# Altium project MSXIV_SolarSense.PrjPcb (part 2 of 3)

## Sheet Current_and_Relay_Sense.SchDoc
size B; Organization: Midnight Sun Solar Rayce Car Team; Address1: University of Waterloo; Address2: 200 University Ave W; Address3: Waterloo, ON, Canada; Address4: N2L 3E9; Website: www.uwmidsun.com
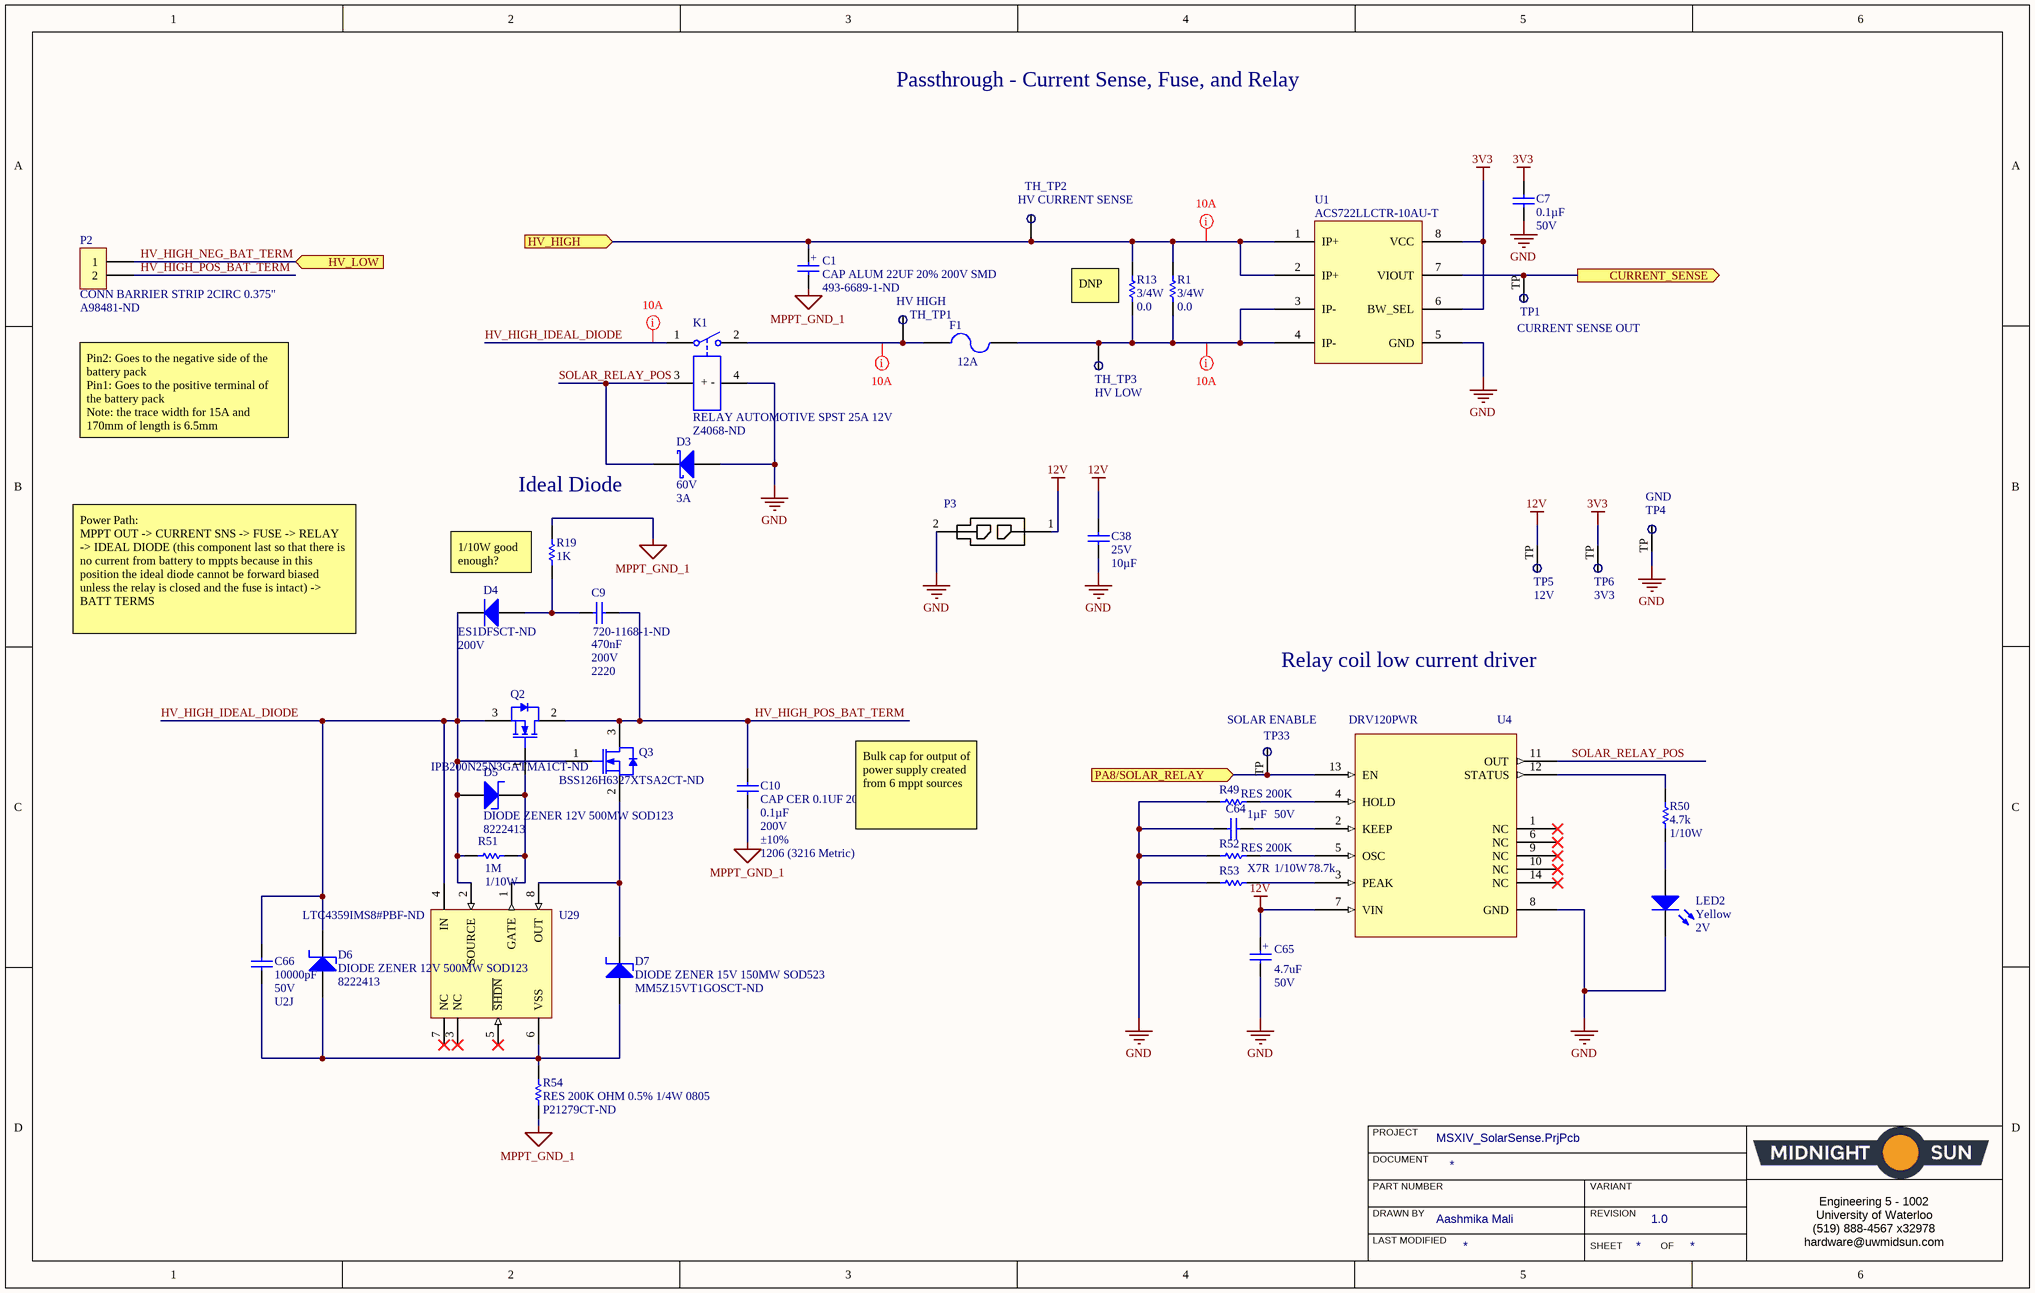
[diagram p4: Current_and_Relay_Sense.SchDoc]

### Parts
C1  CAP ALUM 22UF 20% 200V SMD  Supplier Part Number 1: 493-6689-1-ND  [CAP ALUM 10MMx10MM UUB2D100MNL1GS]
C7  Capacitance: 0.1µF  Voltage: 50V  [CAP, 0603]  (hidden comment: CAP CER 0.1UF 50V 10% X7R 0603)
C9  Capacitance: 470nF  Voltage Rating (DC): 200V  Case/Package: 2220  Supplier Part Number 1: 720-1168-1-ND  [CAP, 2220]  (hidden comment: CAP CER 0.47UF 200V X7R 2220)
C10  CAP CER 0.1UF 200V X7R 1206  Capacitance: 0.1µF  Voltage - Rated: 200V  Tolerance: ±10%  Package / Case: 1206 (3216 Metric)  [CAP, 1206]
C38  Voltage - Rated: 25V  Capacitance: 10µF  [CAP, 0805]  (hidden comment: CAP CER 10uF 25V 10% X5R 0805)
C64  Capacitance: 1µF  Voltage: 50V  Temperature Coefficient: X7R  [CAP, 0603]  (hidden comment: CAP CER 1UF 50V 10% X7R 0603)
C65  Capacitance: 4.7uF  Voltage Rating (DC): 50V  [CAP ALUM 6.3MM RADIAL SMD]  (hidden comment: EEE-1HA4R7NP)
C66  Capacitance: 10000pF  Voltage: 50V  Temperature Coefficient: U2J  [CAP, 0603]  (hidden comment: CAP CER 10nF 50V 5% X7R 0603)
D3  Voltage - DC Reverse (Vr) (Max): 60V  Current - Average Rectified (Io): 3A  [Diode, SMA]  (hidden comment: DIODE SCHOTTKY 60V 3A SMA)
D4  Reverse Voltage: 200V  Supplier Part Number 1: ES1DFSCT-ND  [FAIR-SMA-2_V]  (hidden comment: DIODE GEN PURP 200V 1A SMA)
D5  DIODE ZENER 12V 500MW SOD123  Supplier Part Number 1: 8222413  [SOD123]
D6  DIODE ZENER 12V 500MW SOD123  Supplier Part Number 1: 8222413  [SOD123]
D7  DIODE ZENER 15V 150MW SOD523  Supplier Part Number 1: MM5Z15VT1GOSCT-ND  [SOD-523]
F1  Current Rating: 12A  [FUSE CLIPS 1A3400-09-R]  (hidden comment: FUSE 12 A 600VAC/DC KLM-12)
K1  RELAY AUTOMOTIVE SPST 25A 12V  Supplier Part Number 1: Z4068-ND  [RELAY AUTOMOTIVE SPST 25A 12V]
LED2  Color: Yellow  Voltage - Forward (Vf) (Typ): 2V  [LED_0603]  (hidden comment: LED YELLOW CLEAR 2.1V 0603)
P2  CONN BARRIER STRIP 2CIRC 0.375"  Supplier Part Number 1: A98481-ND  [TE_3-1437652-9]
P3  CONN 2POS MICRO-FIT 3mm  [CONN, 2POS MICRO-FIT]  (value not drawn)
Q2  Supplier Part Number 1: IPB200N25N3GATMA1CT-ND  [INF-PG-TO-263-3-2_A_M]  (hidden comment: MOSFET N-CH 250V 64A TO263-3)
Q3  Supplier Part Number 1: BSS126H6327XTSA2CT-ND  [INF-PG-SOT23_M]  (hidden comment: MOSFET N-CH 600V 0.021A SOT-2326)
R1  Power (Watts): 3/4W  Resistance: 0.0  [RES 1206]  (hidden comment: RES 0.0 OHM 3/4W 1206)
R13  Power (Watts): 3/4W  Resistance: 0.0  [RES 1206]  (hidden comment: RES 0.0 OHM 3/4W 1206)
R19  1K  [RES, 0603]
R49  RES 200K  [0805]
R50  Resistance (Ohms): 4.7k  Power (Watts): 1/10W  [RES, 0603]  (hidden comment: RES 4.7K OHM 1% 1/10W 0603)
R51  Resistance (Ohms): 1M  Power (Watts): 1/10W  [RES, 0603]  (hidden comment: RES 1M OHM 1% 1/10W 0603)
R52  RES 200K  [0805]
R53  Power (Watts): 1/10W  Resistance (Ohms): 78.7k  [RES, 0603]  (hidden comment: RES 78.7K OHM 1% 1/10W 0603)
R54  RES 200K OHM 0.5% 1/4W 0805  Supplier Part Number 1: P21279CT-ND  [0805]
TH_TP1  HV HIGH  [Thru Test Point]
TH_TP2  HV CURRENT SENSE  [Thru Test Point]
TH_TP3  HV LOW  [Thru Test Point]
TP1  CURRENT SENSE OUT  [Test Point]  (no BOM)
TP4  GND  [Test Point]  (no BOM)
TP5  12V  [Test Point]  (no BOM)
TP6  3V3  [Test Point]  (no BOM)
TP33  SOLAR ENABLE  [Test Point]  (no BOM)
U1  Manufacturer Part Number: ACS722LLCTR-10AU-T  [SOIC8]  (hidden comment: IC CURRENT SENSOR HALL EFFECT 8-SOIC)
U4  Manufacturer Part Number: DRV120PWR  [PW14]  (hidden comment: *)
U29  Supplier Part Number 1: LTC4359IMS8#PBF-ND  [LT-MS8-8_N]  (hidden comment: IC LTC4359HS8#PBF IDEAL DIODE CONTROLLER WITH REVE)

### Ports
CURRENT_SENSE (out), HV_HIGH (in), HV_LOW (in), PA8/SOLAR_RELAY (in)

### Nets
3V3: C7.1 TP6.TP U1.6(BW_SEL) U1.8(VCC)
12V: C38.1 C65.1 P3.1 TP5.TP U4.7(VIN)
GND: C7.2 C38.2 C64.1 C65.2 D3.1 K1.4(-) LED2.2(K) P3.2 R49.1 R52.1 R53.1 TP4.TP U1.5(GND) U4.8(GND)
HV_HIGH: C1.1 R1.1 R13.1 TH_TP2.TH_TP U1.1(IP+) U1.2(IP+) ; port HV_HIGH
HV_HIGH_NEG_BAT_TERM: C1.2 C10.2 P2.1 R19.1 R54.2 ; port HV_LOW  [also labelled MPPT_GND_1]
HV_HIGH_IDEAL_DIODE: C66.1 D4.2(K) D5.2(A) D6.1(K) K1.1 Q2.3(SOURCE) Q3.1(GATE) R51.1 U29.2(SOURCE) U29.4(IN)
HV_HIGH_POS_BAT_TERM: C9.2 C10.1 P2.2 Q2.2(DRAIN) Q3.3(DRAIN)
PA8/SOLAR_RELAY: TP33.TP U4.13(EN) ; port PA8/SOLAR_RELAY
SOLAR_RELAY_POS: D3.2 K1.3(+) U4.11(OUT)
NetC9_1: C9.1 D4.1(A) R19.2
NetC64_2: C64.2 U4.2(KEEP)
NetC66_2: C66.2 D6.2(A) D7.1(A) R54.1 U29.6(VSS)
NetD5_1: D5.1(K) Q2.1(GATE) R51.2 U29.1(GATE)
NetD7_2: D7.2(K) Q3.2(SOURCE) U29.8(OUT)
NetF1_1: F1.1 K1.2 TH_TP1.TH_TP
NetF1_2: F1.2 R1.2 R13.2 TH_TP3.TH_TP U1.3(IP-) U1.4(IP-)
NetLED2_1: LED2.1(A) R50.2
NetR18_1: TP1.TP U1.7(VIOUT) ; port CURRENT_SENSE
NetR49_2: R49.2 U4.4(HOLD)
NetR50_1: R50.1 U4.12(STATUS)
NetR52_2: R52.2 U4.5(OSC)
NetR53_2: R53.2 U4.3(PEAK)

Not connected (* = marked no-connect by the designer): U4 1(NC)* 6(NC)* 9(NC)* 10(NC)* 14(NC)*; U29 3(NC)* 5(~{SHDN})* 7(NC)*

### Layout directives
net class 10A: HV_HIGH, HV_HIGH_IDEAL_DIODE, NetF1_1, NetF1_2

### Notes on the sheet
- Passthrough - Current Sense, Fuse, and Relay
- (near R13) DNP
- Pin2: Goes to the negative side of the battery pack
  Pin1: Goes to the positive terminal of the battery pack
  Note: the trace width for 15A and 170mm of length is 6.5mm
- Ideal Diode
- (near R19) 1/10W good enough?
- Power Path:
  MPPT OUT -> CURRENT SNS -> FUSE -> RELAY -> IDEAL DIODE (this component last so that there is no current from battery to mppts because in this position the ideal diode cannot be forward biased unless the relay is closed and the fuse is intact) -> BATT TERMS
- Relay coil low current driver
- Bulk cap for output of power supply created from 6 mppt sources
- PROJECT
- DOCUMENT
- DRAWN BY
- LAST MODIFIED
- PART NUMBER
- REVISION
- SHEET
- VARIANT
- OF
- Engineering 5 - 1002
  University of Waterloo
  (519) 888-4567 x32978
  hardware@uwmidsun.com
- (in symbol CAP ALUM 4.7UF 20% 50V SMD) +
- (in symbol CAP ALUM 22UF 20% 200V SMD) +
- (in symbol RELAY AUTOMOTIVE SPST 25A 12V) + -

### Library data of the parts
C1 = CAP ALUM 22UF 20% 200V SMD: Aluminum Electrolytic Capacitors - SMD 200V 22uF 125C; Manufacturer: Nichicon; Manufacturer Part Number: ULH2D220MNL1GS; Material: Aluminium; Ripple Current: 65mA; Life (Hours): 4000Hour; Leakage Current: 276mA; Supplier 1: Digi-Key; RoHS: Yes; Category: Aluminum Electrolytic Capacitors; Stock 1: 628; Pricing 1: 1=1.12000, 10=0.88400, 100=0.66300 (USD); Mount: Surface Mount; Case/Package: SMD/SMT; Min Operating Temperature: -40°C; Max Operating Temperature: 125°C; Capacitance: 22uF; Voltage Rating (DC): 200V; Tolerance: 20%; Packaging: Tape and Reel; Package Quantity: 1; Termination: SMD/SMT; Voltage Rating: 200V; Voltage: 200V; Diameter: 10mm; Length: 13.5mm; Height: 13.5mm; Height - Seated (Max): 0.571inch; Lead Pitch: 4.5mm; ComponentLink1URL: https://datasheet.ciiva.com/41751/404570-da-01-en-smd-aluminium-kondensator-22uf-200v-41751159.pdf?src-supplier=Conrad; ComponentLink1Description: https://datasheet.ciiva.com/41751/404570-da-01-en-smd-aluminium-kondensator-22uf-200v-41751159.pdf?src-supplier=Conrad; ComponentLink2URL: https://datasheet.ciiva.com/6316/e-lh-6316821.pdf?src-supplier=Digi-Key; ComponentLink2Description: https://datasheet.ciiva.com/6316/e-lh-6316821.pdf?src-supplier=Digi-Key; ComponentLink3URL: https://datasheet.ciiva.com/6316/e-lh-6316822.pdf?src-supplier=Digi-Key; ComponentLink3Description: https://datasheet.ciiva.com/6316/e-lh-6316822.pdf?src-supplier=Digi-Key; ComponentLink4URL: https://datasheet.ciiva.com/6316/e-lh-6316825.pdf?src-supplier=Digi-Key; ComponentLink4Description: https://datasheet.ciiva.com/6316/e-lh-6316825.pdf?src-supplier=Digi-Key
C7 = CAP CER 0.1UF 50V 10% X7R 0603: 0.10µF ±10% 50V Ceramic Capacitor X7R 0603 (1608 Metric); Manufacturer 1: AVX Corporation; Manufacturer Part Number 1: 06035C104KAT2A; Supplier 1: Digi-Key; Supplier Part Number 1: 478-5052-1-ND; Packaging: Cut Tape (CT); Part Status: Active; Operating Temperature: -55°C ~ 125°C; Ratings: -; Mounting Type: Surface Mount, MLCC; Package / Case: 0603 (1608 Metric); Size / Dimension: 0.063" L x 0.032" W (1.60mm x 0.81mm); Height - Seated (Max): -; Thickness (Max): 0.035" (0.90mm); Lead Spacing: -; Lead Style: -; ComponentLink1URL: http://datasheets.avx.com/X7RDielectric.pdf; ComponentLink1Description: http://datasheets.avx.com/X7RDielectric.pdf; Tolerance: ±10%; Temperature Coefficient: X7R
C9 = CAP CER 0.47UF 200V X7R 2220: Manufacturer: Vishay Vitramon; Manufacturer Part Number: VJ2220Y474KXCAT; Tolerance: 10%; Supplier 1: Digi-Key; RoHS: Yes; Category: Ceramic Capacitors; Stock 1: 868; Pricing 1: 1=1.64000, 10=1.29800, 100=0.97370, 500=0.73566 (USD); Mount: Surface Mount; Case Code (Metric): 5750; Case Code (Imperial): 2220; Min Operating Temperature: -55°C; Max Operating Temperature: 125°C; Package Quantity: 1; Voltage Rating: 200V; Packaging: Tape and Reel; Dielectric: X7R; Length: 0.22inch; Width: 0.2inch; Thickness: 0.086inch; Depth: 5.08mm; ComponentLink1URL: https://datasheet.ciiva.com/149/vjcommercialseries-149446.pdf?src-supplier=Digi-Key; ComponentLink1Description: https://datasheet.ciiva.com/149/vjcommercialseries-149446.pdf?src-supplier=Digi-Key; ComponentLink2URL: https://datasheet.ciiva.com/149/vjcommercialseries-149447.pdf?src-supplier=Digi-Key; ComponentLink2Description: https://datasheet.ciiva.com/149/vjcommercialseries-149447.pdf?src-supplier=Digi-Key; ComponentLink3URL: https://datasheet.ciiva.com/149/vjcommercialseries-149445.pdf?src-supplier=Digi-Key; ComponentLink3Description: https://datasheet.ciiva.com/149/vjcommercialseries-149445.pdf?src-supplier=Digi-Key
C10 = CAP CER 0.1UF 200V X7R 1206: Manufacturer 1: Manufacturer; Manufacturer Part Number 1: 885342208002; Supplier 1: Digi-Key; Supplier Part Number 1: 732-12081-1-ND; Temperature Coefficient: X7R
C38 = CAP CER 10uF 25V 10% X5R 0805: 10µF ±10% 25V Ceramic Capacitor X5R 0805 (2012 Metric); Manufacturer: Murata Electronics North America; Manufacturer Part Number: GRM21BR61E106KA73L; Supplier 1: Digi-Key; RoHS: RoHS Compliant; Category: Capacitors; Stock 1: 1695157; Packaging: Cut Tape (CT); Part Status: Active; Tolerance: ±10%; Temperature Coefficient: X5R; Operating Temperature: -55°C ~ 85°C; Features: -; Ratings: -; Applications: General Purpose; Mounting Type: Surface Mount, MLCC; Package / Case: 0805 (2012 Metric); Size / Dimension: 0.079" L x 0.049" W (2.00mm x 1.25mm); Height - Seated (Max): -; Thickness (Max): 0.053" (1.35mm); Lead Spacing: -; Lead Style: -; ComponentLink1URL: http://search.murata.co.jp/Ceramy/image/img/A01X/G101/ENG/GRM21BR61E106KA73-01.pdf; ComponentLink1Description: http://search.murata.co.jp/Ceramy/image/img/A01X/G101/ENG/GRM21BR61E106KA73-01.pdf; Supplier Part Number 1: 490-5523-1-ND; Pricing 1: 1=0.3, 10=0.214, 100=0.1008, 500=0.07068, 1000=0.05851 (CAD)
C64 = CAP CER 1UF 50V 10% X7R 0603: 1µF ±10% 50V Ceramic Capacitor X7R 0603 (1608 Metric); Manufacturer 1: Taiyo Yuden; Manufacturer Part Number 1: UMK107AB7105KA-T; Supplier 1: Digi-Key; Supplier Part Number 1: 587-3247-1-ND; Packaging: Cut Tape (CT); Part Status: Active; Operating Temperature: -55°C ~ 125°C; Ratings: -; Mounting Type: Surface Mount, MLCC; Package / Case: 0603 (1608 Metric); Size / Dimension: 0.063" L x 0.031" W (1.60mm x 0.80mm); Height - Seated (Max): -; Thickness (Max): 0.037" (0.95mm); Lead Spacing: -; Lead Style: -; ComponentLink1URL: http://www.yuden.co.jp/productdata/catalog/en/mlcc_all_e.pdf; ComponentLink1Description: http://www.yuden.co.jp/productdata/catalog/en/mlcc_all_e.pdf; Tolerance: ±10%
C65 = CAP ALUM 4.7UF 20% 50V SMD: 4.7µF 50V Aluminum Electrolytic Capacitors Radial, Can - SMD 2000 Hrs @ 85°C; Manufacturer 1: Panasonic; Description 1: CAPACITOR ALUM ELEC, 4.7UF, 50V, 20%, SMD; Ripple Current: 31mA; Tolerance: 20%; Life (Hours): 2000Hour; Supplier 1: Digi-Key; Supplier Part Number 1: PCE4304CT-ND; Manufacturer Part Number 1: EEE-1HA4R7NP; Stock 1: 19771; Pricing 1: 1=0.43, 10=0.302, 100=0.1986, 500=0.1471 (USD); Mount: Surface Mount,PCB; Case/Package: Radial; Min Operating Temperature: -40°C; Max Operating Temperature: 85°C; Voltage Rating: 50V; Ripple Current (AC): 31mA; Packaging: Tape and Reel; Package Quantity: 1; Termination: SMD/SMT; Diameter: 6.3mm; Length: 5.5mm; Height: 5.4mm; Height - Seated (Max): 0.213inch; Width: 650um; Radiation Hardening: No; REACH SVHC: No SVHC; Lead Free: Lead Free; ComponentLink1URL: https://datasheet.ciiva.com/46374/aba0000ce2-46374373.pdf; ComponentLink1Description: https://datasheet.ciiva.com/46374/aba0000ce2-46374373.pdf; ComponentLink2URL: https://datasheet.ciiva.com/14600/70255710-14600343.pdf; ComponentLink2Description: https://datasheet.ciiva.com/14600/70255710-14600343.pdf; ComponentLink3URL: https://datasheet.ciiva.com/17536/aba0000ce2-17536647.pdf; ComponentLink3Description: https://datasheet.ciiva.com/17536/aba0000ce2-17536647.pdf; ComponentLink4URL: https://datasheet.ciiva.com/24027/aba0000ce2-40801-24027083.pdf; ComponentLink4Description: https://datasheet.ciiva.com/24027/aba0000ce2-40801-24027083.pdf; ComponentLink5URL: https://datasheet.ciiva.com/31414/aba0000ce2-31414684.pdf; ComponentLink5Description: https://datasheet.ciiva.com/31414/aba0000ce2-31414684.pdf; ComponentLink6URL: https://datasheet.ciiva.com/14606/70255710-14606079.pdf; ComponentLink6Description: https://datasheet.ciiva.com/14606/70255710-14606079.pdf
C66 = CAP CER 10nF 50V 5% X7R 0603: 10000pF ±5% 50V Ceramic Capacitor U2J 0603 (1608 Metric); Manufacturer 1: KEMET; Manufacturer Part Number 1: C0603C103J5JAC7867; Supplier 1: Digi-Key; Supplier Part Number 1: 399-13384-1-ND; Packaging: Cut Tape (CT); Part Status: Active; Operating Temperature: -55°C ~ 125°C; Ratings: -; Failure Rate: -; Mounting Type: Surface Mount, MLCC; Package / Case: 0603 (1608 Metric); Size / Dimension: 0.063" L x 0.032" W (1.60mm x 0.80mm); Height - Seated (Max): -; Thickness (Max): 0.034" (0.87mm); Lead Spacing: -; Lead Style: -; ComponentLink1URL: http://www.kemet.com/docfinder?Partnumber=C0603C103J5JAC7867; ComponentLink1Description: http://www.kemet.com/docfinder?Partnumber=C0603C103J5JAC7867; Tolerance: ±5%
D3 = DIODE SCHOTTKY 60V 3A SMA: Diode Schottky 60V 3A Surface Mount SMA; Manufacturer 1: Diodes Incorporated; Manufacturer Part Number 1: B360A-13-F; Voltage - Forward (Vf) (Max) @ If: 700mV @ 3A; Speed: Fast Recovery =< 500ns, > 200mA (Io); Current - Reverse Leakage @ Vr: 500µA @ 60V; Capacitance @ Vr, F: 200pF @ 4V, 1MHz; Supplier 1: Digi-Key; Supplier Part Number 1: B360A-FDICT-ND; Packaging: Cut Tape (CT); Part Status: Active; Diode Type: Schottky; Mounting Type: Surface Mount; Package / Case: DO-214AC, SMA; Supplier Device Package: SMA; Operating Temperature - Junction: -55°C ~ 150°C; ComponentLink1URL: https://www.diodes.com/assets/Datasheets/ds30891.pdf; ComponentLink1Description: https://www.diodes.com/assets/Datasheets/ds30891.pdf
D4 = DIODE GEN PURP 200V 1A SMA: Manufacturer: ON Semiconductor / Fairchild; Manufacturer Part Number: ES1D; Element Configuration: Single; Forward Voltage: 920mV; Peak Reverse Current: 5uA; Reverse Recovery Time: 15ns; Peak Non-Repetitive Surge Current: 30A; Polarity: Standard; Capacitance: 7pF; Power Dissipation: 1.47W; Supplier 1: Digi-Key; RoHS: Yes; Category: Rectifier Diodes; Stock 1: 804358; Pricing 1: 1=0.36000, 10=0.27000, 25=0.23640, 100=0.12840, 250=0.12768, 500=0.10472, 1000=0.07769, 2500=0.06824 (USD); Mount: Surface Mount; Case/Package: SMA; Number of Pins: 2; Contact Plating: Tin,Matte; Min Operating Temperature: -50°C; Max Operating Temperature: 150°C; Packaging: Tape and Reel; Forward Current: 1A; Max Repetitive Reverse Voltage (Vrrm): 200V; Package Quantity: 1; Max Surge Current: 30A; Max Reverse Voltage (DC): 200V; Recovery Time: 15ns; Average Rectified Current: 1A; Max Forward Surge Current (Ifsm): 30A; Voltage Rating (DC): 200V; Current Rating: 1A; Current: 1A; Voltage: 200V; Length: 4.75mm; Height: 2.2mm; Width: 2.95mm; Radiation Hardening: No; Lead Free: Lead Free; REACH SVHC: No SVHC; ComponentLink1URL: https://datasheet.ciiva.com/5739/575529-5739201.pdf?src-supplier=Farnell; ComponentLink1Description: https://datasheet.ciiva.com/5739/575529-5739201.pdf?src-supplier=Farnell; ComponentLink2URL: https://datasheet.ciiva.com/4453/es1d-192752-4453197.pdf?src-supplier=Mouser; ComponentLink2Description: https://datasheet.ciiva.com/4453/es1d-192752-4453197.pdf?src-supplier=Mouser; ComponentLink3URL: https://datasheet.ciiva.com/917/es1a-917873.pdf?src-supplier=Digi-Key; ComponentLink3Description: https://datasheet.ciiva.com/917/es1a-917873.pdf?src-supplier=Digi-Key; ComponentLink4URL: https://datasheet.ciiva.com/17041/es1d-17041659.pdf?src-supplier=Future+Electronics; ComponentLink4Description: https://datasheet.ciiva.com/17041/es1d-17041659.pdf?src-supplier=Future+Electronics; ComponentLink5URL: https://datasheet.ciiva.com/7622/575529-7622988.pdf?src-supplier=Element14; ComponentLink5Description: https://datasheet.ciiva.com/7622/575529-7622988.pdf?src-supplier=Element14; ComponentLink6URL: https://datasheet.ciiva.com/917/es1a-917872.pdf?src-supplier=Digi-Key; ComponentLink6Description: https://datasheet.ciiva.com/917/es1a-917872.pdf?src-supplier=Digi-Key; ComponentLink7URL: https://datasheet.ciiva.com/25951/es1d-25951451.pdf?src-supplier=Avnet+Europe; ComponentLink7Description: https://datasheet.ciiva.com/25951/es1d-25951451.pdf?src-supplier=Avnet+Europe; ComponentLink8URL: https://datasheet.ciiva.com/8300/es1d-8300557.pdf?src-supplier=Avnet; ComponentLink8Description: https://datasheet.ciiva.com/8300/es1d-8300557.pdf?src-supplier=Avnet; ComponentLink9URL: https://datasheet.ciiva.com/917/es1a-917871.pdf?src-supplier=Digi-Key; ComponentLink9Description: https://datasheet.ciiva.com/917/es1a-917871.pdf?src-supplier=Digi-Key; Output Current: 1A
D5 D6 = DIODE ZENER 12V 500MW SOD123: DIODE ZENER 12V 150MW SOD523; Manufacturer: Diodes; Manufacturer Part Number: DDZ9699DICT-ND; Max Reverse Leakage Current: 50nA; Element Configuration: Single; Tolerance: 5%; Test Current: 50uA; Forward Voltage: 900mV; Supplier 1: RSComponents; RoHS: Yes; Category: Zener Diodes; Stock 1: 900; Pricing 1: 100=0.12100, 600=0.10300, 1500=0.08100 (USD); Mount: Surface Mount; Case/Package: SOD-523-2; Number of Pins: 2; Weight: 3.5E-05oz; Min Operating Temperature: -65°C; Max Operating Temperature: 150°C; Max Power Dissipation: 150mW; Zener Voltage: 12V; Packaging: Tape and Reel; Package Quantity: 3000; Voltage Tolerance: 5%; Power Dissipation: 150mW; Zener Current: 50nA; Peak Reverse Current: 50nA; Power Rating: 150mW; Length: 1.7mm; Height: 0.65mm; Width: 0.9mm; Radiation Hardening: No; ComponentLink1URL: https://datasheet.ciiva.com/16561/ds30553-16561727.pdf?src-supplier=Avnet+Europe; ComponentLink1Description: https://datasheet.ciiva.com/16561/ds30553-16561727.pdf?src-supplier=Avnet+Europe
D7 = DIODE ZENER 15V 150MW SOD523: ON SEMICONDUCTOR         MM5Z15VT1G            Zener Single Diode, General Purpose, 15 V, 500 mW, SOD-523, 2 Pins, 150 C; Material: Plastic; Tolerance: 5%; Max Power Dissipation: 200mW; Max Reverse Leakage Current: 50nA; Impedance: 30R; Zener Current: 10mA; Test Current: 5mA; Power Rating: 100mW; ESD Protection: Yes; Forward Voltage: 900mV; Supplier 1: Digi-Key; Manufacturer: ON Semiconductor; Manufacturer Part Number: MM5Z15VT1G; RoHS: Yes; Category: Zener Diodes; Stock 1: 105541; Pricing 1: 1=0.22000, 10=0.17700, 100=0.07250, 500=0.06048, 1000=0.04202 (USD); Case/Package: SOD-523-2; Number of Pins: 2; Contact Plating: Tin,Matte; Min Operating Temperature: -65°C; Max Operating Temperature: 150°C; Zener Voltage: 15V; Packaging: Tape and Reel; Element Configuration: Single; Package Quantity: 3000; Voltage Tolerance: 5%; Power Dissipation: 200mW; Voltage Rating (DC): 15V; Peak Reverse Current: 50nA; Working Voltage: 15V; Length: 1.3mm; Height: 0.7mm; Width: 0.9mm; Radiation Hardening: No; Lead Free: Lead Free; REACH SVHC: No SVHC; ComponentLink1URL: https://datasheet.ciiva.com/15142/getdatasheetpartid-39000-15142029.pdf?src-supplier=Verical; ComponentLink1Description: https://datasheet.ciiva.com/15142/getdatasheetpartid-39000-15142029.pdf?src-supplier=Verical; ComponentLink2URL: https://datasheet.ciiva.com/895/mm5z2v4t1-d-895144.pdf?src-supplier=Digi-Key; ComponentLink2Description: https://datasheet.ciiva.com/895/mm5z2v4t1-d-895144.pdf?src-supplier=Digi-Key; ComponentLink3URL: https://datasheet.ciiva.com/26092/mm5z2v4t1-d-26092189.pdf?src-supplier=Avnet+Europe; ComponentLink3Description: https://datasheet.ciiva.com/26092/mm5z2v4t1-d-26092189.pdf?src-supplier=Avnet+Europe; ComponentLink4URL: https://datasheet.ciiva.com/895/mm5z2v4t1-d-895143.pdf?src-supplier=Digi-Key; ComponentLink4Description: https://datasheet.ciiva.com/895/mm5z2v4t1-d-895143.pdf?src-supplier=Digi-Key; ComponentLink5URL: https://datasheet.ciiva.com/4731/mm5z2v4t1-d-4731183.pdf?src-supplier=Mouser; ComponentLink5Description: https://datasheet.ciiva.com/4731/mm5z2v4t1-d-4731183.pdf?src-supplier=Mouser; ComponentLink6URL: https://datasheet.ciiva.com/895/mm5z2v4t1-d-895142.pdf?src-supplier=Digi-Key; ComponentLink6Description: https://datasheet.ciiva.com/895/mm5z2v4t1-d-895142.pdf?src-supplier=Digi-Key; ComponentLink7URL: https://datasheet.ciiva.com/16206/mm5z2v4t1-d-16206007.pdf?src-supplier=Future+Electronics; ComponentLink7Description: https://datasheet.ciiva.com/16206/mm5z2v4t1-d-16206007.pdf?src-supplier=Future+Electronics; ComponentLink8URL: https://datasheet.ciiva.com/8347/mm5z2v4t1-d-8347806.pdf?src-supplier=Avnet; ComponentLink8Description: https://datasheet.ciiva.com/8347/mm5z2v4t1-d-8347806.pdf?src-supplier=Avnet
F1 = FUSE 12 A 600VAC/DC KLM-12: FUSE CRTRDGE 12A 600VAC/VDC 5AG; Manufacturer: Eaton; Fuse Type: Cartridge; Response Time: Fast; Approvals: CE, CSA, UL; Breaking Capacity @ Rated Voltage: 100kA AC, 50kA DC; Supplier 1: Digi-Key; Manufacturer Part Number: KLM-12; RoHS: RoHS Compliant; Category: Circuit Protection; Stock 1: 0; Pricing 1: 10=39.155 (CAD); Packaging: Bulk; Part Status: Active; Applications: Electrical, Industrial; Features: -; Class: -; Operating Temperature: -; Mounting Type: Holder; Package / Case: 5AG, 10mm x 38.1mm; Size / Dimension: 0.406" Dia x 1.500" L (10.30mm x 38.10mm); ComponentLink1URL: http://www.cooperindustries.com/content/dam/public/bussmann/Electrical/Resources/product-datasheets-a/Bus_Ele_DS_2020_KLM.pdf; ComponentLink1Description: http://www.cooperindustries.com/content/dam/public/bussmann/Electrical/Resources/product-datasheets-a/Bus_Ele_DS_2020_KLM.pdf; Supplier Part Number 1: KLM-12-ND
K1 = RELAY AUTOMOTIVE SPST 25A 12V: Manufacturer: Omron; Manufacturer Part Number: G9EJ-1-DC12; Max Voltage Rating (AC): 400V; Power Consumption: 2W; Coil Resistance: 72R; Coil Current: 167mA; Operate Time: 50ms; Release Time: 30ms; Coil Type: Non-Latching; Supplier 1: Digi-Key; RoHS: Yes; Category: Power Relays; Stock 1: 391; Pricing 1: 1=31.00000, 10=29.45000, 25=27.90000, 50=26.35000, 100=24.80000, 250=23.25000 (USD); Mount: Flanges,Socketable,Plug-In; Number of Pins: 4; Weight: 50g; Min Operating Temperature: -40°C; Max Operating Temperature: 85°C; Max Current Rating: 25A; Contact Current Rating: 25A; Packaging: Bulk; Package Quantity: 10; Max Voltage Rating (DC): 400V; Throw Configuration: SPST; Termination: Quick Connect; Switching Voltage: 400V; Coil Power: 2W; Coil Voltage (DC): 12V; Relay Type: Automotive; Length: 31mm; Height: 30mm; Width: 27mm; Radiation Hardening: No; ComponentLink1URL: https://datasheet.ciiva.com/24086/g9ej-0613-258278-24086896.pdf?src-supplier=Mouser; ComponentLink1Description: https://datasheet.ciiva.com/24086/g9ej-0613-258278-24086896.pdf?src-supplier=Mouser; ComponentLink2URL: https://datasheet.ciiva.com/29981/g9ej-0613-29981763.pdf?src-supplier=Avnet; ComponentLink2Description: https://datasheet.ciiva.com/29981/g9ej-0613-29981763.pdf?src-supplier=Avnet; ComponentLink3URL: https://datasheet.ciiva.com/18528/en-g9ej-18528889.pdf?src-supplier=Digi-Key; ComponentLink3Description: https://datasheet.ciiva.com/18528/en-g9ej-18528889.pdf?src-supplier=Digi-Key; ComponentLink4URL: https://datasheet.ciiva.com/30097/g9ej-0613-30097130.pdf?src-supplier=Onlinecomponents.com; ComponentLink4Description: https://datasheet.ciiva.com/30097/g9ej-0613-30097130.pdf?src-supplier=Onlinecomponents.com
LED2 = LED YELLOW CLEAR 2.1V 0603: Yellow 590nm LED Indication - Discrete 2V 0603 (1608 Metric); Manufacturer: Wurth Electronics Inc.; Manufacturer Part Number: 150060YS75000; Lens Color: Colorless; Millicandela Rating: 120mcd; Lens Style/Size: Rectangle with Flat Top, 1.10mm x 0.70mm; Current - Test: 20mA; Viewing Angle: 140°; Wavelength - Peak: 595nm; Supplier 1: Digi-Key; RoHS: RoHS Compliant; Category: Optoelectronics; Stock 1: 10523; Pricing 1: 1=0.21, 100=0.1617, 500=0.13964 (CAD); Packaging: Cut Tape (CT); Part Status: Active; Lens Transparency: Clear; Mounting Type: Surface Mount; Wavelength - Dominant: 590nm; Features: -; Package / Case: 0603 (1608 Metric); Supplier Device Package: 0603; Size / Dimension: 1.60mm L x 0.80mm W; Height (Max): 0.80mm; ComponentLink1URL: http://katalog.we-online.de/led/datasheet/150060YS75000.pdf; ComponentLink1Description: http://katalog.we-online.de/led/datasheet/150060YS75000.pdf; Supplier Part Number 1: 732-4981-1-ND
P2 = CONN BARRIER STRIP 2CIRC 0.375": Barrier Terminal Blocks 2P TRI-BARRIER .375; Manufacturer: TE Connectivity; Manufacturer Part Number: 6PCV-02-006; Current Rating: 5A; Voltage Rating: 300V; Number of Contacts: 2; Max Current Rating: 25A; Mounting Ears: No (Without); Number of Levels: 1; Wire Gauge (Max): 12AWG; Wire Gauge (Min): 22AWG; Pitch: 9.53mm; Supplier 1: Digi-Key; RoHS: Yes; Category: Terminal Blocks; Stock 1: 8088; Pricing 1: 1=1.63000, 10=1.14400, 25=1.06680, 50=0.96820, 100=0.96400, 250=0.81404, 500=0.77122, 1000=0.68552, 5000=0.55699 (USD); Mount: Through Hole; Color: Black; Terminal Material: Copper Alloy; Contact Plating: Tin; Contact Material: Copper Alloy; Housing Color: Black; Housing Material: Thermoplastic; Package Quantity: 270; Number of Rows: 1; Packaging: Bulk; Termination: Solder; Number of Circuits: 2; Orientation: Straight; Number of Positions: 2; Mounting Insert: No (Without); Voltage: 300V; Length: 0.811inch; Height: 0.625inch; Wire/Cable Gauge: 22AWG; Width: 0.7inch; Flammability Rating: UL94 V-0; REACH SVHC: Unknown; ELV: Compliant; ComponentLink1URL: https://datasheet.ciiva.com/7978/1650932-7978603.pdf?src-supplier=Element14; ComponentLink1Description: https://datasheet.ciiva.com/7978/1650932-7978603.pdf?src-supplier=Element14
P3 = CONN 2POS MICRO-FIT 3mm: Connector Header Through Hole 2 position; Manufacturer: Molex; Manufacturer Part Number: 43045-0227; Number of Positions: 2; Current Rating: 5A; Gender: Male; Contact Resistance: 10mR; Number of Ports: 1; Max Voltage Rating (DC): 250.25kV; Voltage Rating: 600V; Glow Wire Compliant: Compliant; Supplier 1: Digi-Key; Supplier Part Number 1: WM10657-ND; Packaging: Tray; Number of Rows: 2; Termination: Solder; Contact Material: Brass; ComponentLink1URL: http://www.onlinecomponents.com/productFiles/mf-MOL/307170430450227_pcb_headers.pdf; ComponentLink1Description: http://www.onlinecomponents.com/productFiles/mf-MOL/307170430450227_pcb_headers.pdf; Stock 1: 3657; Pricing 1: 1=0.84, 10=0.74, 25=0.6968, 50=0.6676, 100=0.6387, 250=0.5806, 500=0.52254, 1000=0.46448, 2500=0.42094 (USD); Mount: Through Hole; Contact Plating: Tin; Housing Colour: Black; Housing Material: Thermoplastic; Number of Terminals: 2; Min Operating Temperature: -40°C; Max Operating Temperature: 105°C; Number of Contacts: 2; Orientation: Vertical; Package Quantity: 3168; Number of Circuits: 2; Length: 7.15mm; Pitch: 3mm; Depth: 8.77mm; Row Spacing: 3mm; Radiation Hardening: No; Halogen Free: Low Halogen; ComponentLink2URL: http://www.mouser.com/ds/2/276/0430450227_PCB_HEADERS-142611.pdf; ComponentLink2Description: http://www.mouser.com/ds/2/276/0430450227_PCB_HEADERS-142611.pdf; ComponentLink3URL: http://uk.rs-online.com/webdocs/13c3/0900766b813c3a46.pdf; ComponentLink3Description: http://uk.rs-online.com/webdocs/13c3/0900766b813c3a46.pdf; ComponentLink4URL: http://www.molex.com/webdocs/datasheets/pdf/en-us/0430450227_PCB_HEADERS.pdf; ComponentLink4Description: http://www.molex.com/webdocs/datasheets/pdf/en-us/0430450227_PCB_HEADERS.pdf
Q2 = MOSFET N-CH 250V 64A TO263-3: Manufacturer: Infineon; Manufacturer Part Number: IPB200N25N3G; Rise Time: 20ns; Gate to Source Voltage (Vgs): 20V; Fall Time: 12ns; Power Dissipation: 300W; Turn-Off Delay Time: 45ns; Turn-On Delay Time: 18ns; Rds On Max: 20mR; Input Capacitance: 7.1nF; Threshold Voltage: 3V; Supplier 1: Digi-Key; RoHS: Yes; Category: MOSFETs; Stock 1: 1971; Pricing 1: 1=6.36000, 10=5.74600, 25=5.47880, 100=4.54350, 250=4.27624, 500=4.00896 (USD); Case/Package: TO-263-3; Number of Pins: 3; Min Operating Temperature: -55°C; Max Operating Temperature: 175°C; Packaging: Tape and Reel; Continuous Drain Current (ID): 64A; Drain to Source Voltage (Vdss): 250V; Package Quantity: 1000; Drain to Source Breakdown Voltage: 250V; Drain to Source Resistance: 20mR; Max Power Dissipation: 300W; Halogen Free: Halogen Free; Lead Free: Lead Free; REACH SVHC: No SVHC; ComponentLink1URL: https://datasheet.ciiva.com/11171/infineon-ipp-b-i-200n25n3-g-ds-v02-04-en-11171616.pdf?src-supplier=Avnet; ComponentLink1Description: https://datasheet.ciiva.com/11171/infineon-ipp-b-i-200n25n3-g-ds-v02-04-en-11171616.pdf?src-supplier=Avnet; ComponentLink2URL: https://datasheet.ciiva.com/26789/ipb200n25n3-g-26789555.pdf?src-supplier=IIIC; ComponentLink2Description: https://datasheet.ciiva.com/26789/ipb200n25n3-g-26789555.pdf?src-supplier=IIIC; ComponentLink3URL: https://datasheet.ciiva.com/942/infineon-ipp-b-i-200n25n3-g-ds-v02-04-en-942442.pdf?src-supplier=Digi-Key; ComponentLink3Description: https://datasheet.ciiva.com/942/infineon-ipp-b-i-200n25n3-g-ds-v02-04-en-942442.pdf?src-supplier=Digi-Key; ComponentLink4URL: https://datasheet.ciiva.com/942/infineon-ipp-b-i-200n25n3-g-ds-v02-04-en-942443.pdf?src-supplier=Digi-Key; ComponentLink4Description: https://datasheet.ciiva.com/942/infineon-ipp-b-i-200n25n3-g-ds-v02-04-en-942443.pdf?src-supplier=Digi-Key; ComponentLink5URL: https://datasheet.ciiva.com/942/infineon-ipp-b-i-200n25n3-g-ds-v02-04-en-942444.pdf?src-supplier=Digi-Key; ComponentLink5Description: https://datasheet.ciiva.com/942/infineon-ipp-b-i-200n25n3-g-ds-v02-04-en-942444.pdf?src-supplier=Digi-Key
Q3 = BSS1MOSFET N-CH 600V 0.021A SOT-2326: Infineon BSS126 N-channel MOSFET Transistor, 0.021 A, 600 V Depletion, 3-Pin SOT-23; Input Capacitance: 21pF; Max Power Dissipation: 500mW; Rds On Max: 700mR; Continuous Drain Current (ID): 17mA; Gate to Source Voltage (Vgs): 20V; Drain to Source Resistance: 700R; Turn-On Delay Time: 6.1ns; Turn-Off Delay Time: 14ns; Element Configuration: Single; Supplier 1: Digi-Key; Manufacturer: Infineon; Manufacturer Part Number: BSS126; RoHS: Yes; Stock 1: 1746; Pricing 1: 1=0.41000, 10=0.35300, 25=0.32920, 100=0.24450, 250=0.23228, 500=0.19090, 1000=0.15517 (USD); Case/Package: SOT-23; Number of Pins: 3; Min Operating Temperature: -55°C; Max Operating Temperature: 150°C; Packaging: Tape and Reel; Drain to Source Voltage (Vdss): 600V; Max Dual Supply Voltage: 600V; Resistance: 700R; Length: 2.9mm; Height: 1mm; Width: 1.3mm; Halogen Free: Halogen Free; ComponentLink1URL: https://datasheet.ciiva.com/25625/0900766b81074047-25625305.pdf?src-supplier=RSComponents; ComponentLink1Description: https://datasheet.ciiva.com/25625/0900766b81074047-25625305.pdf?src-supplier=RSComponents
R1 R13 = RES 0.0 OHM 3/4W 1206: 0 Ohms Jumper 0.75W, 3/4W Chip Resistor 1206 (3216 Metric) Automotive AEC-Q200 Metal Foil; Manufacturer: Stackpole Electronics Inc.; Manufacturer Part Number: HCJ1206ZT0R00; Supplier 1: Digi-Key; RoHS: RoHS Compliant; Category: Resistors; Stock 1: 1029426; Pricing 1: 1=0.82, 10=0.583, 25=0.4552, 50=0.3852, 100=0.3034, 250=0.25676, 500=0.21006, 1000=0.16337 (CAD); Packaging: Cut Tape (CT); Part Status: Active; Tolerance: Jumper; Composition: Metal Foil; Features: Automotive AEC-Q200; Temperature Coefficient: -; Operating Temperature: -55°C ~ 155°C; Package / Case: 1206 (3216 Metric); Supplier Device Package: 1206; Size / Dimension: 0.122" L x 0.061" W (3.10mm x 1.55mm); Height - Seated (Max): 0.032" (0.80mm); Failure Rate: -; ComponentLink1URL: https://www.seielect.com/catalog/SEI-HCJ.pdf; ComponentLink1Description: https://www.seielect.com/catalog/SEI-HCJ.pdf; Supplier Part Number 1: HCJ1206ZT0R00CT-ND
R19 = RES 1K OHM 5% 1/10W 0603: 1k Ohm ±5% 0.1W, 1/10W Chip Resistor 0603 (1608 Metric); Manufacturer: Yageo; Manufacturer Part Number: RC0603JR-071KL; Temperature Coefficient: ±100ppm/°C; Supplier 1: Digi-Key; Supplier Part Number 1: 311-1.0KGRCT-ND; RoHS: RoHS Compliant; Category: Resistors; Stock 1: 4415240; Pricing 1: 1=0.15, 10=0.017, 100=0.0071, 1000=0.0032, 2500=0.00278 (CAD); Packaging: Cut Tape (CT); Part Status: Active; Resistance (Ohms): 1k; Tolerance: ±5%; Power (Watts): 0.1W, 1/10W; Composition: Thick Film; Features: Moisture Resistant; Operating Temperature: -55°C ~ 155°C; Package / Case: 0603 (1608 Metric); Supplier Device Package: 0603; Size / Dimension: 0.063" L x 0.031" W (1.60mm x 0.80mm); Height - Seated (Max): 0.022" (0.55mm); Failure Rate: -; ComponentLink1URL: http://www.yageo.com/documents/recent/PYu-RC_Group_51_RoHS_L_7.pdf; ComponentLink1Description: http://www.yageo.com/documents/recent/PYu-RC_Group_51_RoHS_L_7.pdf
R49 R52 R54 = RES 200K OHM 0.5% 1/4W 0805: RES SMD 200K OHM 0.5% 1/4W 0805; Manufacturer: Panasonic; Manufacturer Part Number: ERJ-PB6D2003V; Resistance: 200kR; Max Power Dissipation: 250mW; Temperature Coefficient: 50ppm/°C; Supplier 1: Digi-Key; RoHS: Yes; Category: Chip SMD Resistors; Stock 1: 3633; Pricing 1: 1=0.25000, 10=0.21100, 25=0.15320, 50=0.11100, 100=0.08230, 250=0.06316, 500=0.04976, 1000=0.03445 (USD); Case/Package: 0805; Case Code (Metric): 2012; Case Code (Imperial): 0805; Min Operating Temperature: -55°C; Max Operating Temperature: 155°C; Packaging: Tape and Reel; Composition: Thick Film; Number of Terminations: 2; Tolerance: 0.5%; Features: Automotive AEC-Q200; Length: 0.079inch; Width: 0.049inch; Height - Seated (Max): 0.028inch; ComponentLink1URL: https://industrial.panasonic.com/sa/system/files/data/download/catalog/id_fixed-resistors_e_2.pdf?src-supplier=Digi-Key; ComponentLink1Description: https://industrial.panasonic.com/sa/system/files/data/download/catalog/id_fixed-resistors_e_2.pdf?src-supplier=Digi-Key; ComponentLink2URL: https://industrial.panasonic.com/cdbs/www-data/pdf/RDM0000/DMM0000COL5.pdf?src-supplier=Digi-Key; ComponentLink2Description: https://industrial.panasonic.com/cdbs/www-data/pdf/RDM0000/DMM0000COL5.pdf?src-supplier=Digi-Key
  R49 R52: Supplier Part Number 1: P21279CT-ND
R50 = RES 4.7K OHM 1% 1/10W 0603: 4.7k Ohm ±1% 0.1W, 1/10W Chip Resistor 0603 (1608 Metric) Moisture Resistant Thick Film; Manufacturer 1: Yageo; Manufacturer Part Number 1: RC0603FR-074K7L; Description 1: RES SMD 4.7K OHM 1% 1/10W 0603; Temperature Coefficient: ±100ppm/°C; Supplier 1: Digi-Key; Supplier Part Number 1: 311-4.70KHRCT-ND; RoHS: RoHS Compliant; Category: Resistors; Stock 1: 3487566; Pricing 1: 1=0.16, 10=0.022, 100=0.0089, 1000=0.00402, 2500=0.00349 (CAD); Packaging: Cut Tape (CT); Part Status: Active; Composition: Thick Film; Features: Moisture Resistant; Operating Temperature: -55°C ~ 155°C; Package / Case: 0603 (1608 Metric); Supplier Device Package: 0603; Size / Dimension: 0.063" L x 0.031" W (1.60mm x 0.80mm); Height - Seated (Max): 0.022" (0.55mm); Failure Rate: -; ComponentLink1URL: http://www.yageo.com/documents/recent/PYu-RC_Group_51_RoHS_L_7.pdf; ComponentLink1Description: http://www.yageo.com/documents/recent/PYu-RC_Group_51_RoHS_L_7.pdf; Tolerance: ±1%
R51 = RES 1M OHM 1% 1/10W 0603: 1M Ohm ±1% 0.1W, 1/10W Chip Resistor 0603 (1608 Metric) Moisture Resistant Thick Film; Manufacturer 1: Yageo; Manufacturer Part Number 1: RC0603FR-071ML; Description 1: RES SMD 1M OHM 1% 1/10W 0603; Temperature Coefficient: ±100ppm/°C; Supplier 1: Digi-Key; Supplier Part Number 1: 311-1.00MHRCT-ND; RoHS: RoHS Compliant; Category: Resistors; Stock 1: 2336711; Pricing 1: 1=0.16, 10=0.022, 100=0.0089, 1000=0.00402, 2500=0.00349 (CAD); Packaging: Cut Tape (CT); Part Status: Active; Composition: Thick Film; Features: Moisture Resistant; Operating Temperature: -55°C ~ 155°C; Package / Case: 0603 (1608 Metric); Supplier Device Package: 0603; Size / Dimension: 0.063" L x 0.031" W (1.60mm x 0.80mm); Height - Seated (Max): 0.022" (0.55mm); Failure Rate: -; ComponentLink1URL: http://www.yageo.com/documents/recent/PYu-RC_Group_51_RoHS_L_7.pdf; ComponentLink1Description: http://www.yageo.com/documents/recent/PYu-RC_Group_51_RoHS_L_7.pdf; Tolerance: ±1%
R53 = RES 78.7K OHM 1% 1/10W 0603: 78.7k Ohm ±1% 0.1W, 1/10W Chip Resistor 0603 (1608 Metric) Automotive AEC-Q200 Thick Film; Manufacturer: Panasonic Electronic Components; Manufacturer Part Number: ERJ-3EKF7872V; Temperature Coefficient: ±100ppm/°C; RoHS: RoHS Compliant; Category: Resistors; Packaging: Cut Tape (CT); Part Status: Active; Composition: Thick Film; Features: Automotive AEC-Q200; Operating Temperature: -55°C ~ 155°C; Package / Case: 0603 (1608 Metric); Supplier Device Package: 0603; Size / Dimension: 0.063" L x 0.031" W (1.60mm x 0.80mm); Height - Seated (Max): 0.022" (0.55mm); Failure Rate: -; ComponentLink1URL: https://industrial.panasonic.com/cdbs/www-data/pdf/RDA0000/AOA0000C298.pdf; ComponentLink1Description: https://industrial.panasonic.com/cdbs/www-data/pdf/RDA0000/AOA0000C298.pdf; Supplier 1: Digi-Key; Supplier Part Number 1: P78.7KHCT-ND; Tolerance: ±1%
TH_TP1-TH_TP3 = Thru Test Point
TP1 TP4-TP6 TP33 = Test Point
U1 = IC CURRENT SENSOR HALL EFFECT 8-SOIC: Current Sensor 10A 1 Channel Hall Effect, Open Loop Unidirectional 8-SOIC (0.154", 3.90mm Width); Manufacturer: Allegro MicroSystems, LLC; For Measuring: DC; Output: Ratiometric, Voltage; Sensitivity: 264mV/A; Frequency: DC ~ 80kHz; Linearity: ±1%; Accuracy: ±3%; Voltage - Supply: 3 V ~ 3.6 V; Response Time: 5µs; Current - Supply (Max): 12mA; Supplier 1: Digi-Key; RoHS: RoHS Compliant; Category: Sensors, Transducers; Stock 1: 5711; Pricing 1: 1=8.22, 5=7.25, 10=6.404, 25=5.1948, 50=4.5908, 100=4.4701, 500=3.74526, 1000=3.50362 (CAD); Packaging: Cut Tape (CT); Part Status: Active; Sensor Type: Hall Effect, Open Loop; Current - Sensing: 10A; Operating Temperature: -40°C ~ 150°C; Polarization: Unidirectional; Mounting Type: Surface Mount; Package / Case: 8-SOIC (0.154", 3.90mm Width); ComponentLink1URL: http://www.allegromicro.com/~/media/Files/Datasheets/ACS722-Datasheet.ashx; ComponentLink1Description: http://www.allegromicro.com/~/media/Files/Datasheets/ACS722-Datasheet.ashx; Supplier Part Number 1: 620-1636-1-ND
U4 = IC PWR DRIVER N-CHAN 1:1 14TSSOP: IC PWM SOLENOID DRVR 8TSSOP; Manufacturer: Texas Instruments; Output Current: 160mA; Number of Outputs: 1; Interface: On/Off; Fault Protection: Over Temperature; Operating Supply Voltage: 26V; Output Configuration: Low Side; Supplier 1: Digi-Key; RoHS: Yes; Category: Amplifiers - Op Amps, Buffer, Instrumentation; Stock 1: 1985; Pricing 1: 1=2.43000, 10=2.18400, 25=2.06000, 100=1.64800, 250=1.44200, 500=1.40080, 1000=1.11240 (USD); Mount: Surface Mount; Case/Package: TSSOP; Number of Pins: 8; Min Operating Temperature: -40°C; Max Operating Temperature: 105°C; Packaging: Tape and Reel; Package Quantity: 2000; Length: 3.1mm; Radiation Hardening: No; Lead Free: Lead Free; ComponentLink1URL: https://datasheet.ciiva.com/26931/getdatasheetpartid-613822-26931129.pdf?src-supplier=Verical; ComponentLink1Description: https://datasheet.ciiva.com/26931/getdatasheetpartid-613822-26931129.pdf?src-supplier=Verical; ComponentLink2URL: https://datasheet.ciiva.com/6609/drv120-6609494.pdf?src-supplier=Digi-Key; ComponentLink2Description: https://datasheet.ciiva.com/6609/drv120-6609494.pdf?src-supplier=Digi-Key; ComponentLink3URL: https://datasheet.ciiva.com/6609/drv120-6609493.pdf?src-supplier=Digi-Key; ComponentLink3Description: https://datasheet.ciiva.com/6609/drv120-6609493.pdf?src-supplier=Digi-Key; Supplier Part Number 1: 296-34777-1-ND
U29 = IC LTC4359HS8#PBF IDEAL DIODE CONTROLLER WITH REVE: Voltage Detector IC MSOP-8, LTC4359IMS8#PBF, Linear Technology; Manufacturer: Analog Devices / Linear Technology; Max Supply Voltage: 80V; Max Output Current: 180mA; Min Supply Voltage: 4V; Turn-Off Delay Time: 500ns; Number of Drivers: 1; Nominal Supply Current: 150uA; Supplier 1: Digi-Key; Manufacturer Part Number: LTC4359IMS8#PBF; RoHS: Yes; Category: Voltage Supervisors; Stock 1: 3812; Pricing 1: 1=5.87000, 25=3.89440, 100=3.22000 (USD); Case/Package: MSOP; Number of Pins: 8; Min Operating Temperature: -40°C; Max Operating Temperature: 85°C; Package Quantity: 50; Number of Outputs: 1; Lead Free: Lead Free; ComponentLink1URL: https://datasheet.ciiva.com/6609/4359fb-6609591.pdf?src-supplier=Digi-Key; ComponentLink1Description: https://datasheet.ciiva.com/6609/4359fb-6609591.pdf?src-supplier=Digi-Key

## Sheet TemperatureSense.SchDoc
size Letter; Organization: Midnight Sun Solar Rayce Car Team; Address1: University of Waterloo; Address2: 200 University Ave W; Address3: Waterloo, ON, Canada; Address4: N2L 3E9; Website: www.uwmidsun.com
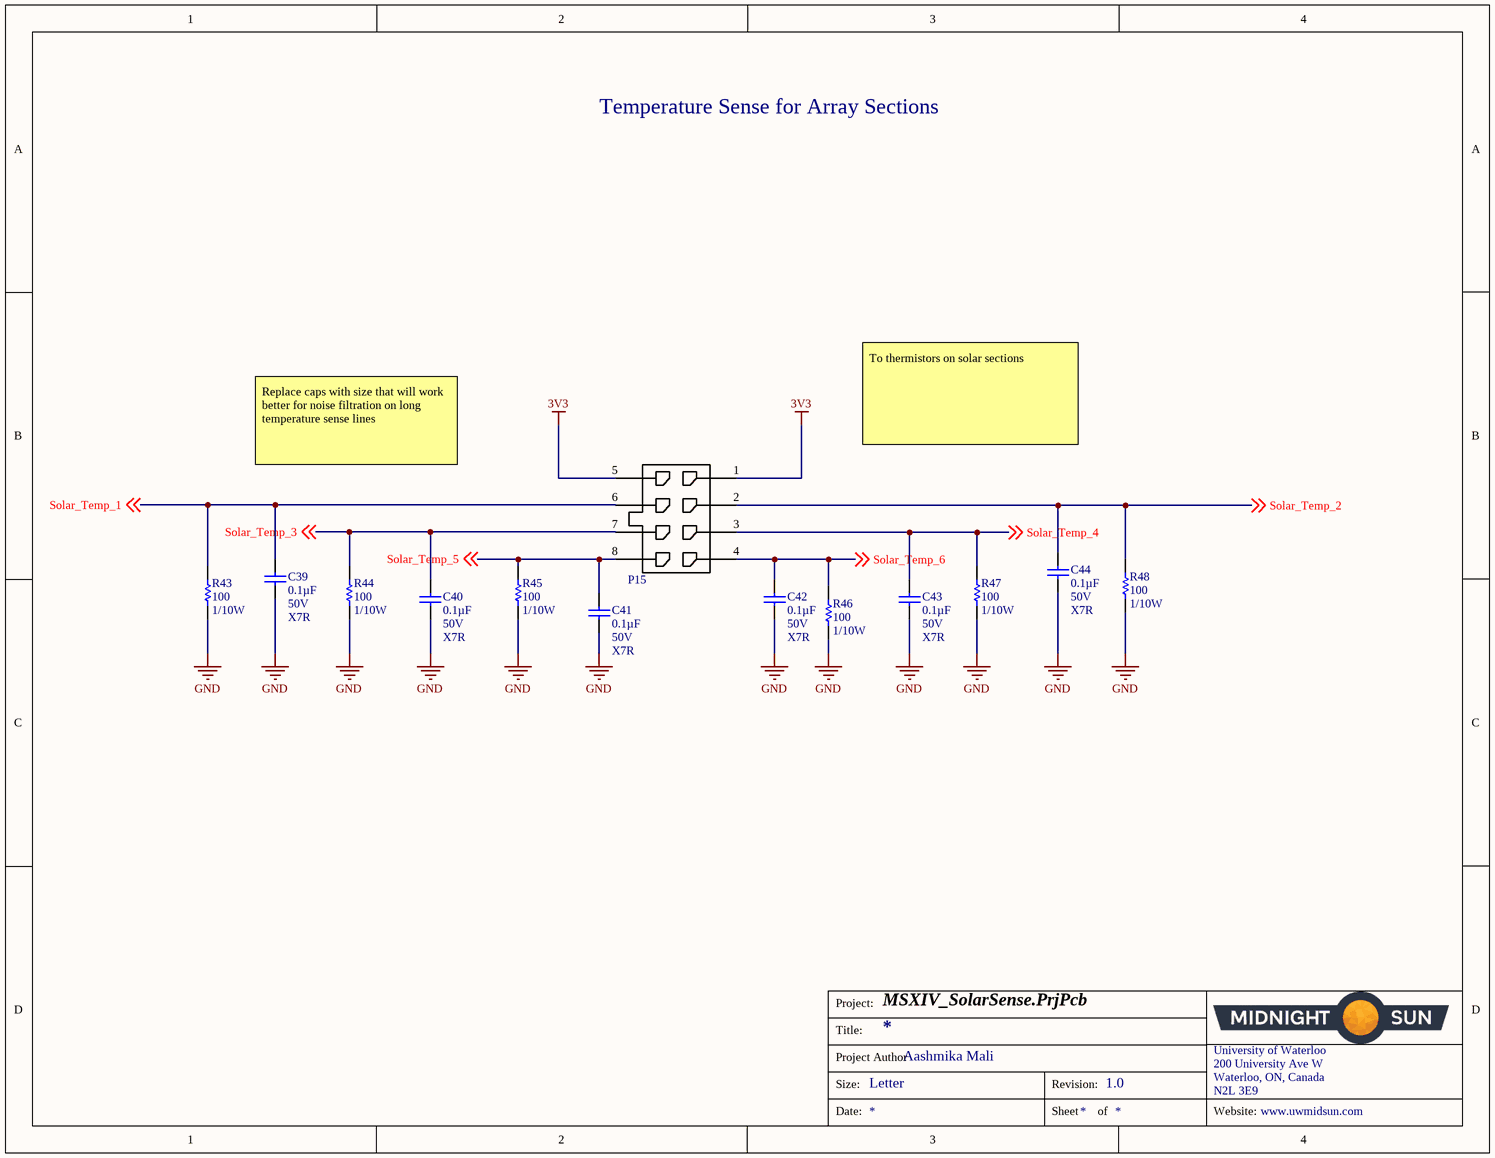
[diagram p5: TemperatureSense.SchDoc]

### Parts
C39  Capacitance: 0.1µF  Voltage: 50V  Temperature Coefficient: X7R  [CAP, 0603]  (hidden comment: CAP CER 0.1UF 50V 10% X7R 0603)
C40  Capacitance: 0.1µF  Voltage: 50V  Temperature Coefficient: X7R  [CAP, 0603]  (hidden comment: CAP CER 0.1UF 50V 10% X7R 0603)
C41  Capacitance: 0.1µF  Voltage: 50V  Temperature Coefficient: X7R  [CAP, 0603]  (hidden comment: CAP CER 0.1UF 50V 10% X7R 0603)
C42  Capacitance: 0.1µF  Voltage: 50V  Temperature Coefficient: X7R  [CAP, 0603]  (hidden comment: CAP CER 0.1UF 50V 10% X7R 0603)
C43  Capacitance: 0.1µF  Voltage: 50V  Temperature Coefficient: X7R  [CAP, 0603]  (hidden comment: CAP CER 0.1UF 50V 10% X7R 0603)
C44  Capacitance: 0.1µF  Voltage: 50V  Temperature Coefficient: X7R  [CAP, 0603]  (hidden comment: CAP CER 0.1UF 50V 10% X7R 0603)
P15  CONN 8POS MICRO-FIT 3mm  [CONN, 8POS MICRO-FIT]  (value not drawn)
R43  Resistance: 100  Power: 1/10W  [RES, 0603]  (hidden comment: RES 100 OHM 1% 1/10W 0603)
R44  Resistance: 100  Power: 1/10W  [RES, 0603]  (hidden comment: RES 100 OHM 1% 1/10W 0603)
R45  Resistance: 100  Power: 1/10W  [RES, 0603]  (hidden comment: RES 100 OHM 1% 1/10W 0603)
R46  Resistance: 100  Power: 1/10W  [RES, 0603]  (hidden comment: RES 100 OHM 1% 1/10W 0603)
R47  Resistance: 100  Power: 1/10W  [RES, 0603]  (hidden comment: RES 100 OHM 1% 1/10W 0603)
R48  Resistance: 100  Power: 1/10W  [RES, 0603]  (hidden comment: RES 100 OHM 1% 1/10W 0603)

### Nets
3V3: P15.1 P15.5
GND: C39.2 C40.2 C41.2 C42.2 C43.2 C44.2 R43.2 R44.2 R45.2 R46.2 R47.2 R48.2
Solar_Temp_1: C39.1 P15.6 R43.1 ; off-sheet Solar_Temp_1  [project net PA0_Temp_1]
Solar_Temp_2: C44.1 P15.2 R48.1 ; off-sheet Solar_Temp_2  [project net PA1_Temp_2]
Solar_Temp_3: C40.1 P15.7 R44.1 ; off-sheet Solar_Temp_3  [project net PA2_Temp_3]
Solar_Temp_4: C43.1 P15.3 R47.1 ; off-sheet Solar_Temp_4  [project net PA3_Temp_4]
Solar_Temp_5: C41.1 P15.8 R45.1 ; off-sheet Solar_Temp_5  [project net PA4_Temp_5]
Solar_Temp_6: C42.1 P15.4 R46.1 ; off-sheet Solar_Temp_6  [project net PA5_Temp_6]

### Notes on the sheet
- Temperature Sense for Array Sections
- Replace caps with size that will work better for noise filtration on long temperature sense lines
- To thermistors on solar sections
- Project:
- Title:
- Size:
- Project Author
- Letter
- Revision:
- University of Waterloo
- 200 University Ave W
- Waterloo, ON, Canada
- N2L 3E9
- Date:
- Sheet
- of
- Website:

### Library data of the parts
C39-C44 = CAP CER 0.1UF 50V 10% X7R 0603: as C7 on sheet Current_and_Relay_Sense; Supplier 1: Digi-Key; Supplier Part Number 1: 478-5052-1-ND; Packaging: Cut Tape (CT); Part Status: Active; Operating Temperature: -55°C ~ 125°C; Ratings: -; Mounting Type: Surface Mount, MLCC; Package / Case: 0603 (1608 Metric); Size / Dimension: 0.063" L x 0.032" W (1.60mm x 0.81mm); Height - Seated (Max): -; Thickness (Max): 0.035" (0.90mm); Lead Spacing: -; Lead Style: -; ComponentLink1URL: http://datasheets.avx.com/X7RDielectric.pdf; ComponentLink1Description: http://datasheets.avx.com/X7RDielectric.pdf; Tolerance: ±10%
P15 = CONN 8POS MICRO-FIT 3mm: Connector Header Through Hole 6 position 0.118" (3.00mm); Manufacturer: Molex, LLC; Manufacturer Part Number: 0430450827; Number of Positions: 6; Number of Positions Loaded: All; Style: Board to Cable/Wire; Shrouding: Shrouded - 4 Wall; Contact Length - Post: 0.125" (3.18mm); Material Flammability Rating: UL94 V-0; RoHS: RoHS Compliant; Category: Connectors, Interconnects; Packaging: Tray; Part Status: Active; Connector Type: Header; Contact Type: Male Pin; Pitch - Mating: 0.118" (3.00mm); Number of Rows: 2; Row Spacing - Mating: 0.118" (3.00mm); Mounting Type: Through Hole; Termination: Solder; Fastening Type: Locking Ramp; Contact Length - Mating: -; Overall Contact Length: -; Insulation Height: 0.390" (9.91mm); Contact Shape: Square; Contact Finish - Mating: Tin; Contact Finish Thickness - Mating: 60.0µin (1.52µm); Contact Finish - Post: Tin; Contact Material: Brass; Insulation Material: Liquid Crystal Polymer (LCP), Glass Filled; Features: Board Guide; Operating Temperature: -; Ingress Protection: -; Insulation Color: Black; Current Rating: -; Voltage Rating: -; Mated Stacking Heights: -; Contact Finish Thickness - Post: -; Applications: General Purpose, Medical, Military, Telecommunications; ComponentLink1URL: https://www.molex.com/pdm_docs/sd/430450627_sd.pdf; ComponentLink1Description: https://www.molex.com/pdm_docs/sd/430450627_sd.pdf; Supplier 1: Digi-Key; Stock 1: 5553; Pricing 1: 1=2.69, 10=2.445, 25=2.2964, 50=2.1964, 100=2.0965, 250=1.8968, 500=1.74704, 1440=1.49746, 2880=1.39763 (CAD); ComponentLink2URL: https://www.molex.com/pdm_docs/sd/430450827_sd.pdf; ComponentLink2Description: https://www.molex.com/pdm_docs/sd/430450827_sd.pdf; Supplier Part Number 1: WM10684-ND
R43-R48 = RES 100 OHM 1% 1/10W 0603: 100 Ohm ±1% 0.1W, 1/10W Chip Resistor 0603 (1608 Metric) Moisture Resistant Thick Film; Manufacturer 1: Yageo; Manufacturer Part Number 1: RC0603FR-07100RL; Temperature Coefficient: ±100ppm/°C; Supplier 1: Digi-Key; Supplier Part Number 1: 311-100HRCT-ND; Packaging: Cut Tape (CT); Part Status: Active; Composition: Thick Film; Operating Temperature: -55°C ~ 155°C; Package / Case: 0603 (1608 Metric); Supplier Device Package: 0603; Size / Dimension: 0.063" L x 0.031" W (1.60mm x 0.80mm); Height - Seated (Max): 0.022" (0.55mm); Failure Rate: -; ComponentLink1URL: http://www.yageo.com/documents/recent/PYu-RC_Group_51_RoHS_L_7.pdf; ComponentLink1Description: http://www.yageo.com/documents/recent/PYu-RC_Group_51_RoHS_L_7.pdf; Tolerance: ±1%